# EAGLE design PowerLevel (EAGLE 6.1)
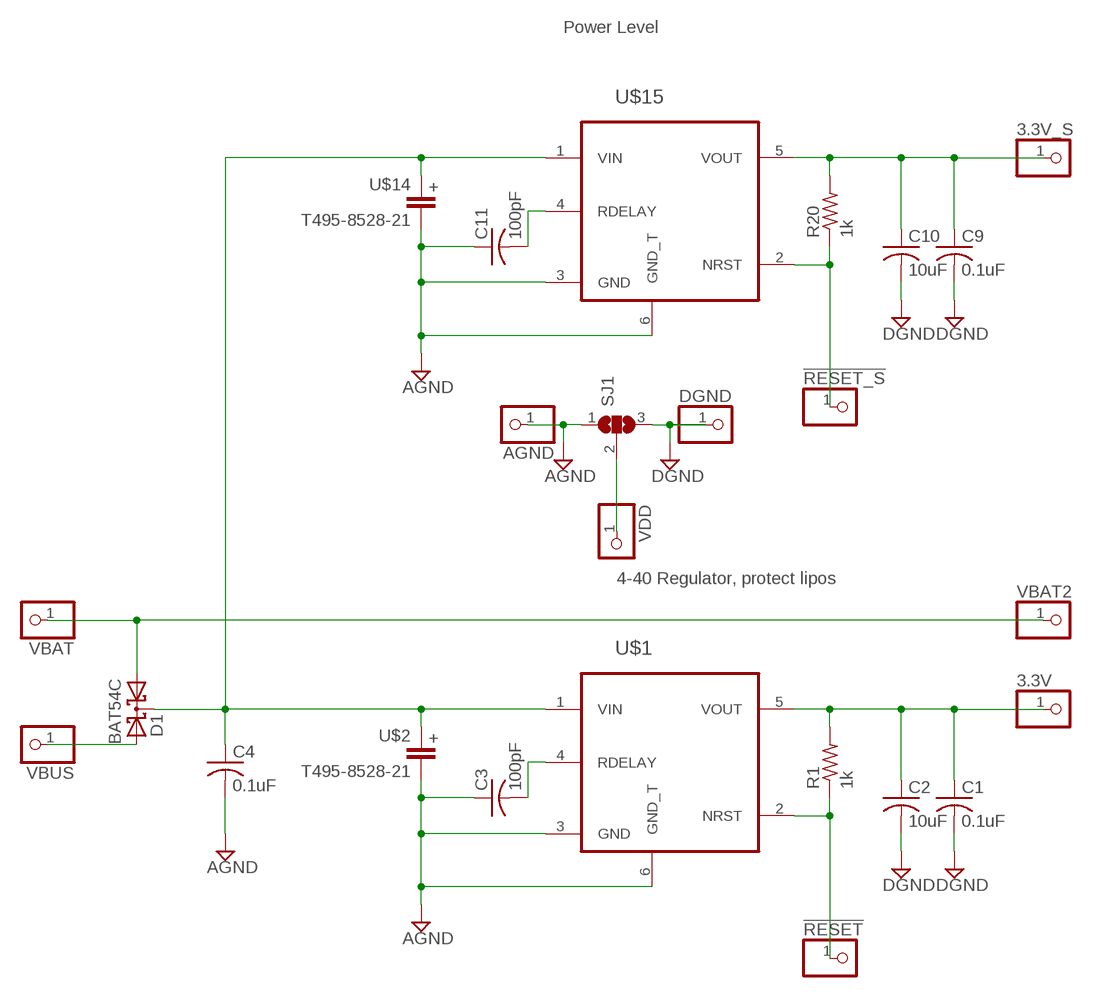
[diagram p0: schematic, sheet 1]

## Parts
3.3V  PINHD-1X1  [1X01]
3.3V_S  PINHD-1X1  [1X01]
!RESET  PINHD-1X1  [1X01]
!RESET_S  PINHD-1X1  [1X01]
AGND  PINHD-1X1  [1X01]
C1  0.1uF  C-USC0402  [C0402]
C2  10uF  C-USC0402  [C0402]
C3  100pF  C-USC0402K  [C0402K]
C4  0.1uF  C-USC0402K  [C0402K]
C9  0.1uF  C-USC0402  [C0402]
C10  10uF  C-USC0402  [C0402]
C11  100pF  C-USC0402K  [C0402K]
D1  BAT54C  [SOT23]
DGND  PINHD-1X1  [1X01]
R1  1k  R-US_R0402  [R0402]
R20  1k  R-US_R0402  [R0402]
SJ1  SJ2WW  [SJ_2W]
U$1  TPS7A6033-Q1  [TO-263-5]
U$2  T495-8528-21  [8528-21]
U$14  T495-8528-21  [8528-21]
U$15  TPS7A6033-Q1  [TO-263-5]
VBAT  PINHD-1X1  [1X01]
VBAT2  PINHD-1X1  [1X01]
VBUS  PINHD-1X1  [1X01]
VDD  PINHD-1X1  [1X01]

## Nets
3.3V_SECONDARY: 3.3V_S.1 C9.1 C10.1 R20.2 U$15.5(VOUT)
AGND: AGND.1 C3.1 C4.2 C11.1 SJ1.1 U$1.3(GND) U$1.6(GND_T) U$2.NEG U$14.NEG U$15.3(GND) U$15.6(GND_T)
DGND: C1.2 C2.2 C9.2 C10.2 DGND.1 SJ1.3
N$1: 3.3V.1 C1.1 C2.1 R1.2 U$1.5(VOUT)
N$2: C4.1 D1.3(CC) U$1.1(VIN) U$2.POS U$14.POS U$15.1(VIN)
N$3: SJ1.2 VDD.1
N$4: C3.2 U$1.4(RDELAY)
N$5: C11.2 U$15.4(RDELAY)
N$6: !RESET.1 R1.1 U$1.2(NRST)
N$7: !RESET_S.1 R20.1 U$15.2(NRST)
VBAT: D1.1(A1) VBAT2.1 VBAT.1
VUSB: D1.2(A2) VBUS.1

## Notes on the sheet
- Power Level
- 4-40 Regulator, protect lipos

## Library data of the parts
3.3V 3.3V_S !RESET !RESET_S AGND DGND VBAT VBAT2 VBUS VDD = pinhead:PINHD-1X1: PIN HEADER
C1-C4 C9-C11 = rcl:C-US: CAPACITOR, American symbol
D1 = diode:BAT54C: Schottky Diodes Source: Fairchild .. BAT54.pdf
R1 R20 = rcl:R-US_: RESISTOR, American symbol
SJ1 = jumper:SJ2W: SMD solder JUMPER
U$1 U$15 = TI_TPS:TPS7A6033-Q1: TPS7A6033-Q1
U$2 U$14 = Kemet:T495-8528-21: T495 Surge Robust Low ESR Capacitor, 3528-21 Package

## Board
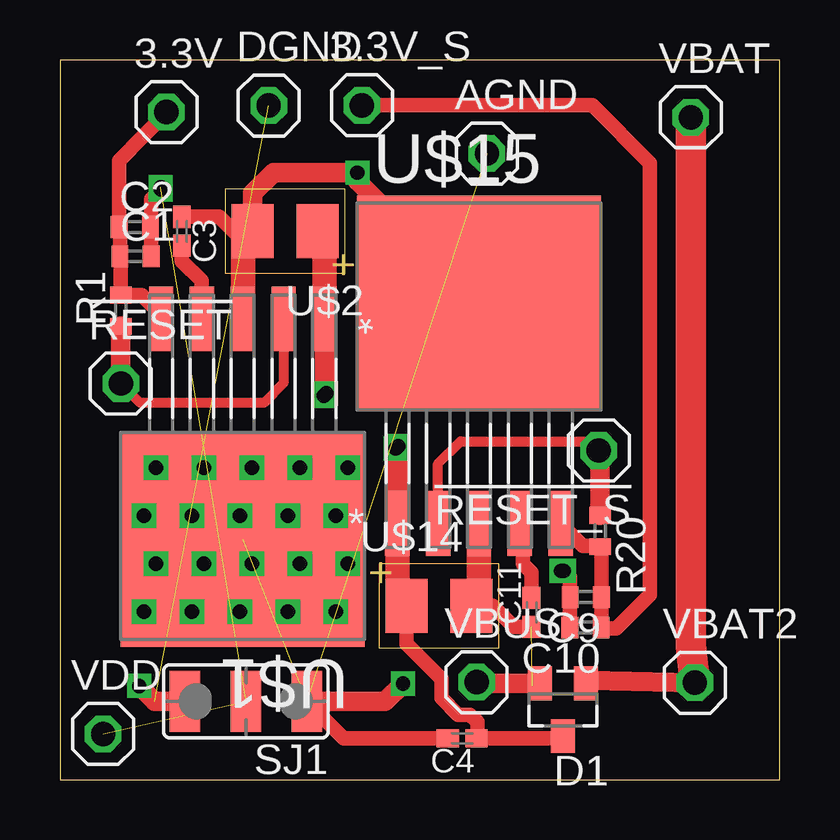
[diagram p1: board, top side]
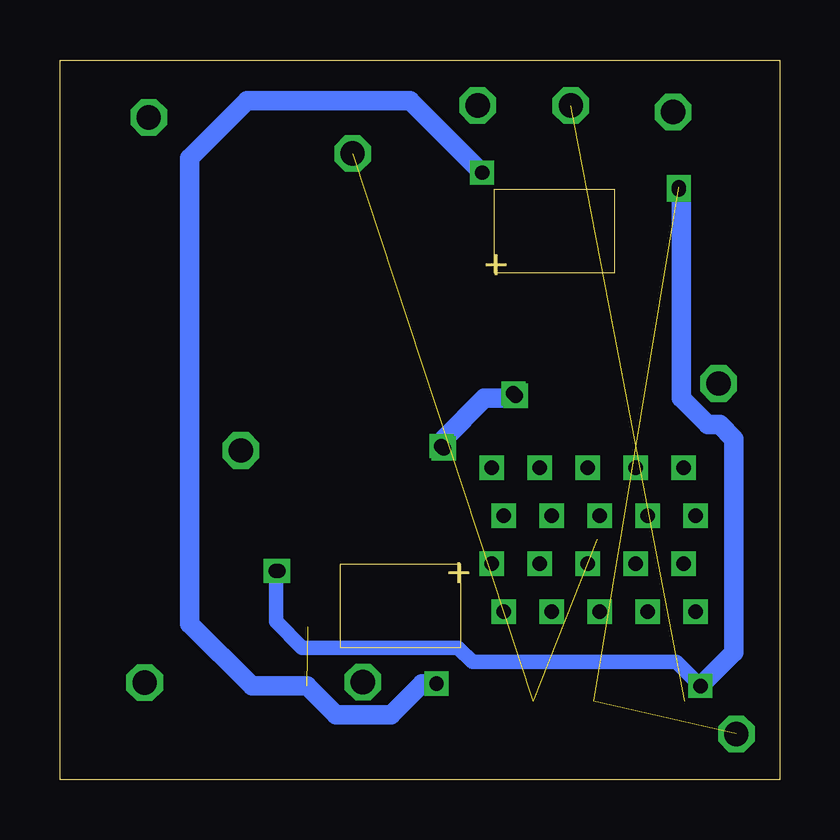
[diagram p2: board, bottom side, seen from below]

Size 30 x 30 mm. Coordinates in mm from the lower left corner, seen from the top.
Outline: 0,0 30,0 30,30 0,30 0,0
Copper layers (1*16): Top 0.035mm / dielectric 1.5mm / Bottom 0.035mm
Design rules: minimum track width 10mil, minimum drill 24mil, track to track 8mil, track to pad 8mil, pad to pad 8mil, via to via 8mil, smd to smd 8mil, copper to edge 40mil, drill to drill 8mil, minimum pad ring 10mil, minimum via ring 8mil, stop-mask expansion 4mil, vias tented up to drill 0mil, thermal gap 10mil

### Footprints (pad centres in the part's own frame; a part is rotated, then mirrored left to right if it is on the bottom)
1X01 = drill 1.016 octagon: 1 0,0
C0402 = smd 0.7 x 0.9: 1 -0.65,0; 2 0.65,0
C0402K = smd 0.925 x 0.74: 1 -0.6,0; 2 0.6,0
SOT23 = smd 1 x 1.4: 1 -0.95,-1.1; 2 0.95,-1.1; 3 0,1.1
R0402 = smd 0.7 x 0.9: 1 -0.65,0; 2 0.65,0
SJ_2W = smd 1.27 x 2.54: 1 -2.54,0; 2 0,0; 3 2.54,0
TO-263-5 = smd 1.016 x 2.692: 1 -3.404,-7.772; 2 -1.702,-7.772; 3 0,-7.772; 4 1.702,-7.772; 5 3.404,-7.772 | smd 10.16 x 8.941: 6 0,1.422
8528-21 = smd 1.75 x 2.25: NEG 1.35,0; POS -1.35,0

### Placement (x,y rotation side)
3.3V  4.44,27.83 0 top
3.3V_S  12.59,28.11 0 top
!RESET  2.54,16.51 0 top
!RESET_S  22.46,13.72 180 top
AGND  17.8,26.1 0 top
C1  3.15,21.81 0 top
C2  3.12,23.03 0 top
C3  5.08,22.86 270 top
C4  16.77,1.72 180 top
C9  21.92,7.61 180 top
C10  21.91,6.34 180 top
C11  19.66,6.97 90 top
D1  20.97,2.91 180 top
DGND  8.7,28.1 0 top
R1  2.54,19.55 90 top
R20  22.52,10.36 270 top
SJ1  7.75,3.26 180 top
U$1  7.62,11.43 180 top
U$2  9.39,22.86 180 top
U$14  15.8,7.25 0 top
U$15  17.47,18.45 0 top
VBAT  26.3,27.61 0 top
VBAT2  26.47,4.04 0 top
VBUS  17.37,4.06 0 top
VDD  1.8,1.9 0 top

### Tracks (layer width: path | path; a pad name or v marks a point on that pad's centre or on a via)
3.3V_SECONDARY
  Top 0.61: U$15.5 21.8,9.75 22.48,9.75 R20.2 22.57,9.66 C9.1 C10.1 22.6,6.3 23.2,6.3 24.6,7.7 24.6,25.7 22.19,28.11 3.3V_S.1
AGND  (via drill 0.6)  (3 unrouted)
  Top 0.61: C3.1 6.64,23.46 7.64,22.46 | C11.1 18.93,6.37 18.05,7.25 U$14.NEG | C4.2 11.83,1.72 SJ1.1
  Top 0.813: SJ1.1 13.56,3.26 v14.3,4 | U$15.6 12.4,24.94 v12.4,25.3 8.9,25.3 8.04,24.44 U$2.NEG
  Top 1.016: U$1.3 7.64,19.38 7.64,22.46 U$2.NEG | U$15.3 17.47,7.57 U$14.NEG
  Bottom 0.813: v14.3,4 14.9,4 16.2,2.7 18.5,2.7 19.7,3.9 22,3.9 24.6,6.5 24.6,25.9 22.2,28.3 15.4,28.3 v12.4,25.3
DGND  (via drill 0.6)  (1 unrouted)
  Top 0.61: C1.2 3.8,23 C2.2 3.8,23.06 3.8,24.2 v4.2,24.6 | C9.2 C10.2 21.26,8.44 v21,8.7
  Top 0.813: SJ1.3 3.94,3.26 v3.3,3.9
  Bottom 0.61: v21,8.7 21,6.6 19.9,5.5 13.4,5.5 12.8,4.9 4.3,4.9 v3.3,3.9
  Bottom 0.813: v3.3,3.9 1.9,5.3 1.9,14.2 2.5,14.8 3,14.8 4.1,15.9 4.1,24.5 v4.2,24.6
N$1
  Top 0.61: U$1.5 4.22,19.38 3.4,20.2 R1.2 2.54,21.77 C1.1 2.5,23 C2.1 2.47,25.8 3.3V.1
N$2  (via drill 0.6)
  Top 0.61: U$14.POS 14.45,5.65 15.9,4.2 15.9,3.4 16.6,2.7 17.1,2.7 17.4,2.4 17.4,1.75 C4.1 20.88,1.72 D1.3
  Top 0.813: U$15.1 14.07,13.73 v14,13.8 | U$1.1 11.02,16.02 v11,16
  Top 1.016: U$1.1 11.02,22.58 U$2.POS | U$15.1 14.07,7.63 U$14.POS
  Bottom 0.813: v14,13.8 14,14.2 12.3,15.9 11.4,15.9 | 11.4,15.9 11.1,15.9 v11,16 11.3,16 11.4,15.9
N$3  (via drill 0.6)  (2 unrouted)
  other vias: 4.2,24.7
N$4
  Top 0.61: C3.2 5.08,21.62 5.9,20.8 5.9,19.22 U$1.4
N$5
  Top 0.61: C11.2 19.66,8.64 19.3,9 19.3,10.55 U$15.4
N$6
  Top 0.406: U$1.2 9.32,16.52 8.5,15.7 3.35,15.7 !RESET.1
  Top 0.813: R1.1 !RESET.1
N$7
  Top 0.406: U$15.2 15.77,13.17 16.7,14.1 22.08,14.1 !RESET_S.1 22.52,13.66
  Top 0.813: R20.1 22.52,13.66
N$8  (via drill 0.6)
  other vias: 20.9,8.7
N$9  (via drill 0.6)
  other vias: 4,13
N$10  (via drill 0.6)
  other vias: 6,13
N$11  (via drill 0.6)
  other vias: 8,13
N$12  (via drill 0.6)
  other vias: 10,13
N$13  (via drill 0.6)
  other vias: 11.5,11
N$14  (via drill 0.6)
  other vias: 9.5,11
N$15  (via drill 0.6)
  other vias: 7.5,11
N$16  (via drill 0.6)
  other vias: 5.5,11
N$17  (via drill 0.6)
  other vias: 4,9
N$18  (via drill 0.6)
  other vias: 6,9
N$19  (via drill 0.6)
  other vias: 8,9
N$20  (via drill 0.6)
  other vias: 10,9
N$21  (via drill 0.6)
  other vias: 11.5,7
N$22  (via drill 0.6)
  other vias: 9.5,7
N$23  (via drill 0.6)
  other vias: 7.5,7
N$24  (via drill 0.6)
  other vias: 5.5,7
N$25  (via drill 0.6)
  other vias: 3.5,7
N$26  (via drill 0.6)
  other vias: 3.5,11
N$27  (via drill 0.6)
  other vias: 12,13
N$28  (via drill 0.6)
  other vias: 12,9
N$29  (via drill 0.6)
  other vias: 14.3,4
N$30  (via drill 0.6)
  other vias: 14.1,13.9
N$31  (via drill 0.6)
  other vias: 11.1,16.1
VBAT
  Top 0.813: VBAT2.1 22.05,4.14 D1.1
  Top 1.27: VBAT.1 26.3,5.57 VBAT2.1
VUSB
  Top 0.813: D1.2 17.42,4.01 VBUS.1